# EAGLE design ampli (EAGLE 6.4)
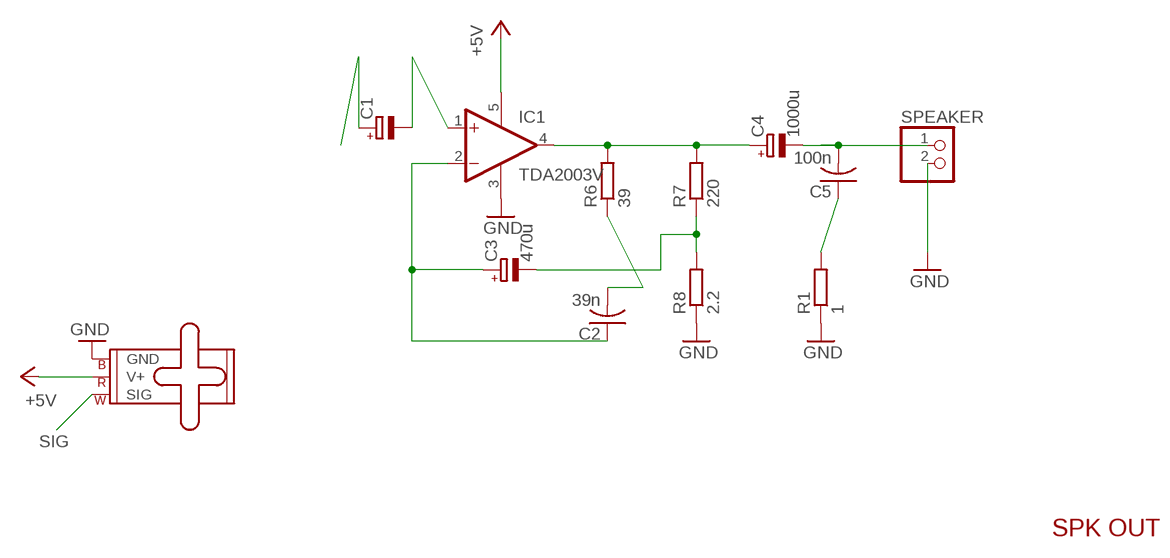
[diagram p0: schematic, sheet 1]

## Parts
C1  CPOL-EUE2.5-6  [E2,5-6]
C2  39n  C-USC0805  [C0805]
C3  470u  CPOL-EUE2.5-6  [E2,5-6]
C4  1000u  CPOL-EUE2.5-6  [E2,5-6]
C5  100n  C-USC0805  [C0805]
IC1  TDA2003V  [CB360]
LED  SMALL_SERVO  [1X03]
R1  1  R-EU_R0805  [R0805]
R6  39  R-EU_R0805  [R0805]
R7  220  R-EU_R0805  [R0805]
R8  2.2  R-EU_R0805  [R0805]
SPEAKER  PINHD-1X2  [1X02]

## Nets
+5V: IC1.5(V+) LED.2(V+)
GND: IC1.3(GND) LED.3(GND) R1.1 R8.1 SPEAKER.2
N$2: C1.- IC1.1(+IN)
N$3: C2.2 R6.1
N$4: C5.1 R1.2
N$5: C3.- R7.1 R8.2
N$6: C2.1 C3.+ IC1.2(-IN)
N$7: C4.- C5.2 SPEAKER.1
N$8: C4.+ IC1.4(OUT) R6.2 R7.2
SIG: C1.+ LED.1(SIG)

## Notes on the sheet
- SPK OUT

## Library data of the parts
C1 C3 C4 = resistor:CPOL-EU: POLARIZED CAPACITOR, European symbol
C2 C5 = adafruit:C-US: CAPACITOR, American symbol
IC1 = linear:TDA2003: AUDIO AMPLIFIER
LED = SparkFun-Electromechanical:SMALL_SERVO: Small servo motor This is the small servo used in the SIK. SKU: ROB-09065
R1 R6-R8 = resistor:R-EU_: RESISTOR, European symbol
SPEAKER = pinhead:PINHD-1X2: PIN HEADER

## Board
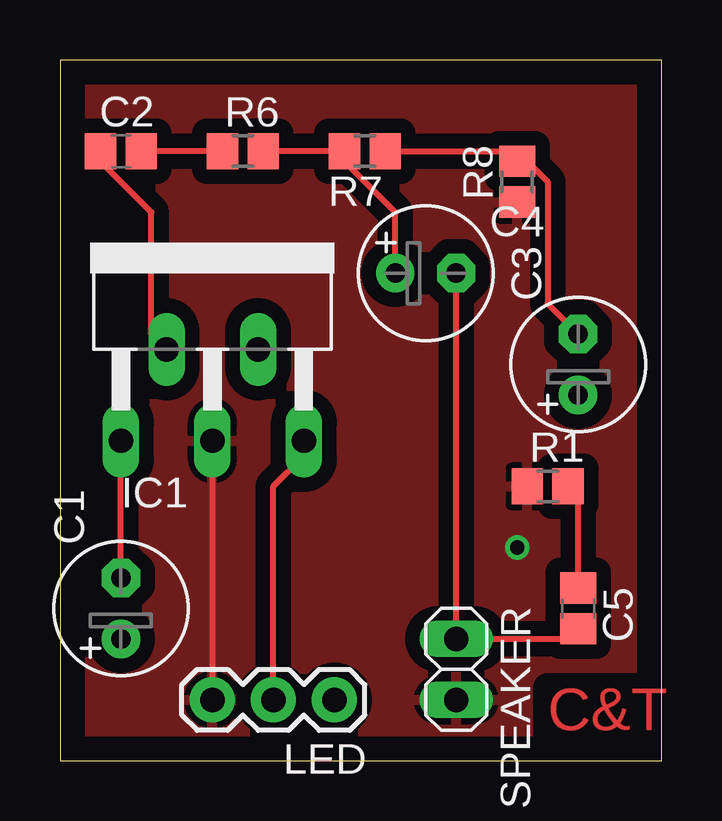
[diagram p1: board, top side]
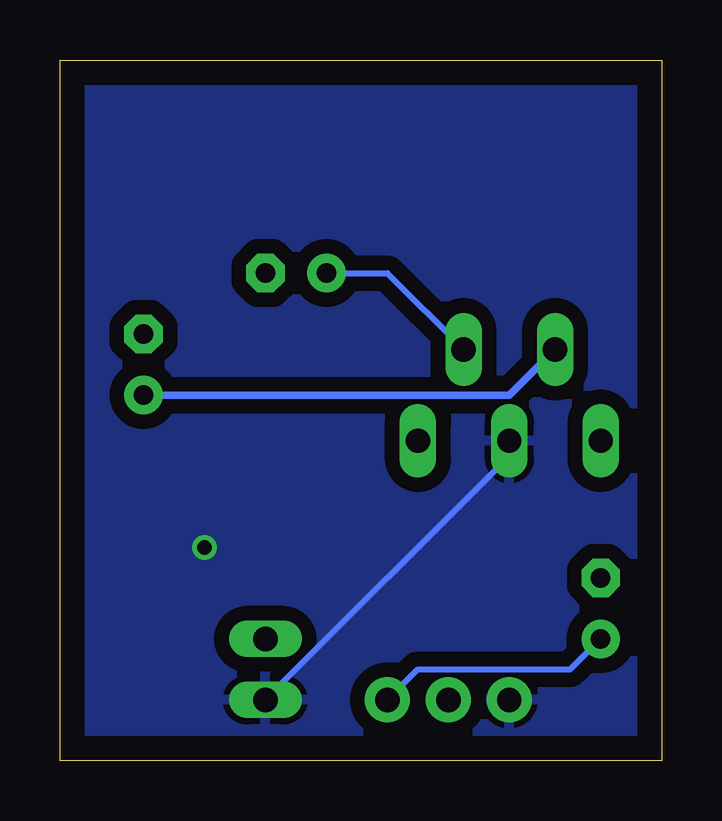
[diagram p2: board, bottom side, seen from below]

Size 25.07 x 29.2 mm. Coordinates in mm from the lower left corner, seen from the top.
Outline: 0,0 25.07,0 25.07,29.2 0,29.2 0,0
Copper layers (1*16): Top 0.035mm / dielectric 1.5mm / Bottom 0.035mm
Design rules "default": minimum track width 10mil, minimum drill 24mil, track to track 8mil, track to pad 8mil, pad to pad 8mil, via to via 8mil, smd to smd 8mil, copper to edge 40mil, drill to drill 8mil, minimum pad ring 10mil, minimum via ring 8mil, stop-mask expansion 4mil, vias tented up to drill 0mil, thermal gap 10mil

### Footprints (pad centres in the part's own frame; a part is rotated, then mirrored left to right if it is on the bottom)
E2,5-6 = drill 0.813 pad 1.6: + -1.27,0 | drill 0.813 pad 1.6 octagon: - 1.27,0
C0805 = smd 1.3 x 1.5: 1 -0.85,0; 2 0.85,0
CB360 = drill 1.016 long: 1 -3.81,-8.255; 2 -1.905,-4.445; 3 0,-8.255; 4 1.905,-4.445; 5 3.81,-8.255
1X03 = drill 1.016 pad 1.88: 1 0,0; 2 2.54,0; 3 5.08,0
R0805 = smd 1.3 x 1.5: 1 -0.85,0; 2 0.85,0
1X02 = drill 1.016 long: 1 -1.27,0; 2 1.27,0

### Placement (x,y rotation side)
C1  2.54,6.35 90 top
C2  2.54,25.4 0 top
C3  21.59,16.51 90 top
C4  15.24,20.32 0 top
C5  21.59,6.35 270 top
IC1  6.35,21.59 0 top
LED  11.43,2.54 180 top
R1  20.32,11.43 0 top
R6  7.62,25.4 0 top
R7  12.7,25.4 180 top
R8  19.05,24.13 90 top
SPEAKER  16.51,3.81 270 top

### Tracks (layer width: path | path; a pad name or v marks a point on that pad's centre or on a via)
+5V
  Top 0.254: LED.2 8.89,11.43 10.16,12.7 IC1.5
GND  (via drill 0.6)
  Top 0.254: IC1.3 LED.3
  Bottom 0.254: SPEAKER.2 6.35,12.7 IC1.3
  other vias: 19.05,8.89
  pour Bottom (isolate 0.61): 0,27.94 25.4,27.94 25.4,0 0,0
  pour Top (isolate 0.61): -3.81,30.48 -3.81,-3.81 29.21,-3.81 29.21,30.48
N$2
  Top 0.254: C1.- IC1.1
N$3
  Top 0.254: R6.1 C2.2
N$4
  Top 0.254: C5.1 21.59,11.43 R1.2
N$5
  Top 0.254: R7.1 19.05,25.4 | C3.- 20.32,19.05 20.32,24.13 19.05,25.4 | 19.05,25.4 R8.2
N$6
  Top 0.254: C2.1 1.27,25.4 3.81,22.86 3.81,17.78 IC1.2
  Bottom 0.305: C3.+ 6.35,15.24 IC1.2
N$7
  Top 0.254: C5.2 21.59,5.08 SPEAKER.1 C4.-
N$8
  Top 0.254: 11.43,25.4 R6.2 | 11.43,25.4 13.97,22.86 C4.+ | 11.43,25.4 R7.2
  Bottom 0.254: IC1.4 11.43,20.32 C4.+
SIG
  Bottom 0.254: C1.+ 3.81,3.81 10.16,3.81 LED.1

### Text on the board
Top: C&T